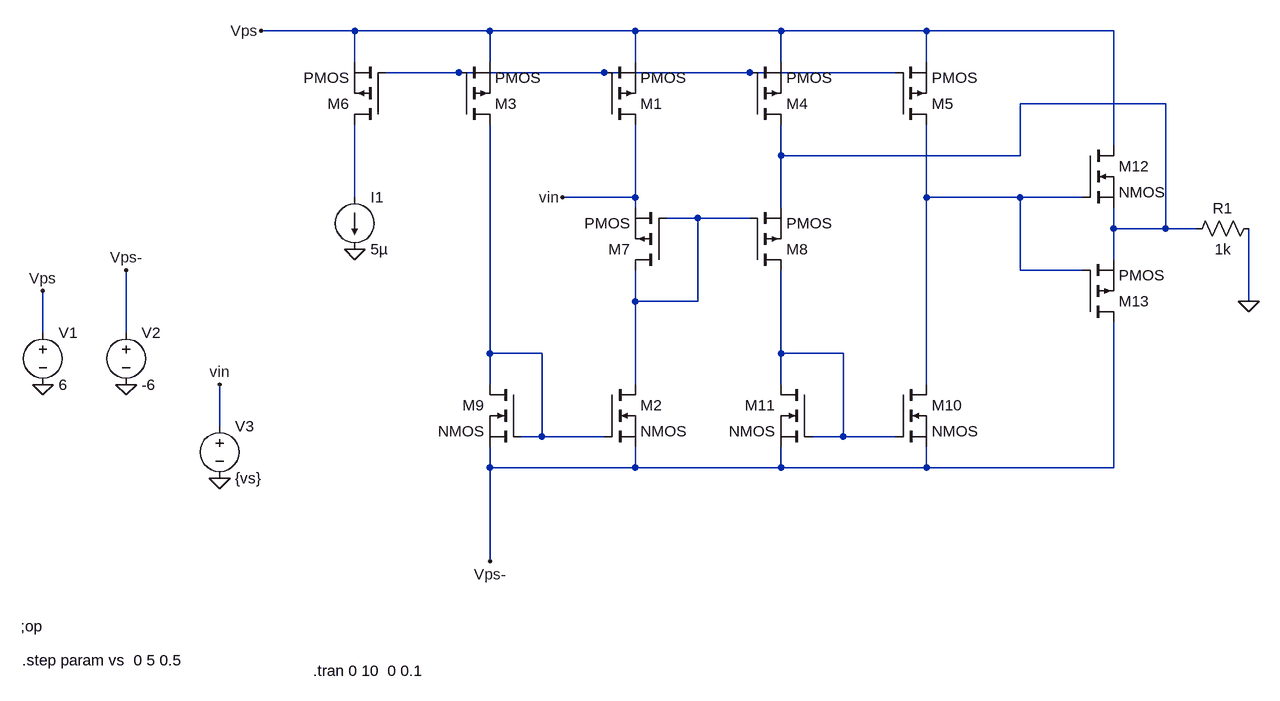
[diagram p0: schematic Draft1.asc]
Draft1.asc, the LTspice schematic file:
Version 4
SHEET 1 1092 936
WIRE -304 -64 -448 -64
WIRE -96 -64 -304 -64
WIRE 128 -64 -96 -64
WIRE 352 -64 128 -64
WIRE 576 -64 352 -64
WIRE 864 -64 576 -64
WIRE -304 -16 -304 -64
WIRE -96 -16 -96 -64
WIRE 128 -16 128 -64
WIRE 352 -16 352 -64
WIRE 576 -16 576 -64
WIRE -144 0 -256 0
WIRE 80 0 -144 0
WIRE 304 0 80 0
WIRE 528 0 304 0
WIRE 944 48 720 48
WIRE 864 112 864 -64
WIRE 352 128 352 80
WIRE 720 128 720 48
WIRE 720 128 352 128
WIRE -304 192 -304 80
WIRE 128 192 128 80
WIRE 128 192 16 192
WIRE 576 192 576 80
WIRE 720 192 576 192
WIRE 816 192 720 192
WIRE 128 208 128 192
WIRE 352 208 352 128
WIRE 224 224 176 224
WIRE 304 224 224 224
WIRE 864 240 864 208
WIRE 944 240 944 48
WIRE 944 240 864 240
WIRE 992 240 944 240
WIRE 864 288 864 240
WIRE 720 304 720 192
WIRE 816 304 720 304
WIRE 128 352 128 304
WIRE 224 352 224 224
WIRE 224 352 128 352
WIRE 1072 352 1072 240
WIRE -784 400 -784 336
WIRE -656 400 -656 304
WIRE -96 432 -96 80
WIRE -16 432 -96 432
WIRE 352 432 352 304
WIRE 448 432 352 432
WIRE -96 480 -96 432
WIRE 128 480 128 352
WIRE 352 480 352 432
WIRE 576 480 576 192
WIRE -512 544 -512 480
WIRE -16 560 -16 432
WIRE -16 560 -48 560
WIRE 80 560 -16 560
WIRE 448 560 448 432
WIRE 448 560 400 560
WIRE 528 560 448 560
WIRE -96 608 -96 576
WIRE 128 608 128 576
WIRE 128 608 -96 608
WIRE 352 608 352 576
WIRE 352 608 128 608
WIRE 576 608 576 576
WIRE 576 608 352 608
WIRE 864 608 864 384
WIRE 864 608 576 608
WIRE -96 752 -96 608
FLAG -304 272 0
FLAG 1072 352 0
FLAG -96 752 Vps-
FLAG -448 -64 Vps
FLAG -784 480 0
FLAG -656 480 0
FLAG -784 336 Vps
FLAG -656 304 Vps-
FLAG 16 192 vin
FLAG -512 624 0
FLAG -512 480 vin
DATAFLAG 352 384 ""
DATAFLAG 224 224 ""
DATAFLAG 128 352 ""
DATAFLAG 128 112 ""
DATAFLAG 352 112 ""
DATAFLAG 576 192 ""
DATAFLAG 880 240 ""
DATAFLAG 128 176 ""
SYMBOL pmos 80 80 M180
SYMATTR InstName M1
SYMBOL nmos 80 480 R0
SYMATTR InstName M2
SYMBOL pmos -144 80 M180
SYMATTR InstName M3
SYMBOL pmos 304 80 M180
SYMATTR InstName M4
SYMBOL pmos 528 80 M180
SYMATTR InstName M5
SYMBOL pmos -256 80 R180
SYMATTR InstName M6
SYMBOL pmos 176 304 R180
SYMATTR InstName M7
SYMBOL pmos 304 304 M180
SYMATTR InstName M8
SYMBOL nmos -48 480 M0
SYMATTR InstName M9
SYMBOL nmos 528 480 R0
SYMATTR InstName M10
SYMBOL nmos 400 480 M0
SYMATTR InstName M11
SYMBOL current -304 192 R0
WINDOW 123 0 0 Left 0
WINDOW 39 0 0 Left 0
SYMATTR InstName I1
SYMATTR Value 5µ
SYMBOL nmos 816 112 R0
SYMATTR InstName M12
SYMBOL pmos 816 384 M180
SYMATTR InstName M13
SYMBOL res 1088 224 R90
WINDOW 0 0 56 VBottom 2
WINDOW 3 32 56 VTop 2
SYMATTR InstName R1
SYMATTR Value 1k
SYMBOL voltage -784 384 R0
WINDOW 123 0 0 Left 0
WINDOW 39 0 0 Left 0
SYMATTR InstName V1
SYMATTR Value 6
SYMBOL voltage -656 384 R0
WINDOW 123 0 0 Left 0
WINDOW 39 0 0 Left 0
SYMATTR InstName V2
SYMATTR Value -6
SYMBOL voltage -512 528 R0
WINDOW 123 0 0 Left 0
WINDOW 39 0 0 Left 0
SYMATTR InstName V3
SYMATTR Value {vs}
TEXT -818 852 Left 2 !;op
TEXT -816 904 Left 2 !.step param vs  0 5 0.5
TEXT -368 920 Left 2 !.tran 0 10  0 0.1

The netlist it stands for:
* Draft1.asc
M1 vin N001 Vps Vps PMOS
M2 N005 N006 Vps- Vps- NMOS
M3 N006 N001 Vps Vps PMOS
M4 N002 N001 Vps Vps PMOS
M5 N004 N001 Vps Vps PMOS
M6 N003 N001 Vps Vps PMOS
M7 N005 N005 vin vin PMOS
M8 N007 N005 N002 N002 PMOS
M9 N006 N006 Vps- Vps- NMOS
M10 N004 N007 Vps- Vps- NMOS
M11 N007 N007 Vps- Vps- NMOS
I1 N003 0 5µ
M12 Vps N004 N002 N002 NMOS
M13 Vps- N004 N002 N002 PMOS
R1 0 N002 1k
V1 Vps 0 6
V2 Vps- 0 -6
V3 vin 0 {vs}
.model NMOS NMOS
.model PMOS PMOS
.lib standard.mos
;op
.step param vs  0 5 0.5
.tran 0 10  0 0.1
.backanno
.end